# EAGLE schematic clock (EAGLE 7.3.0)
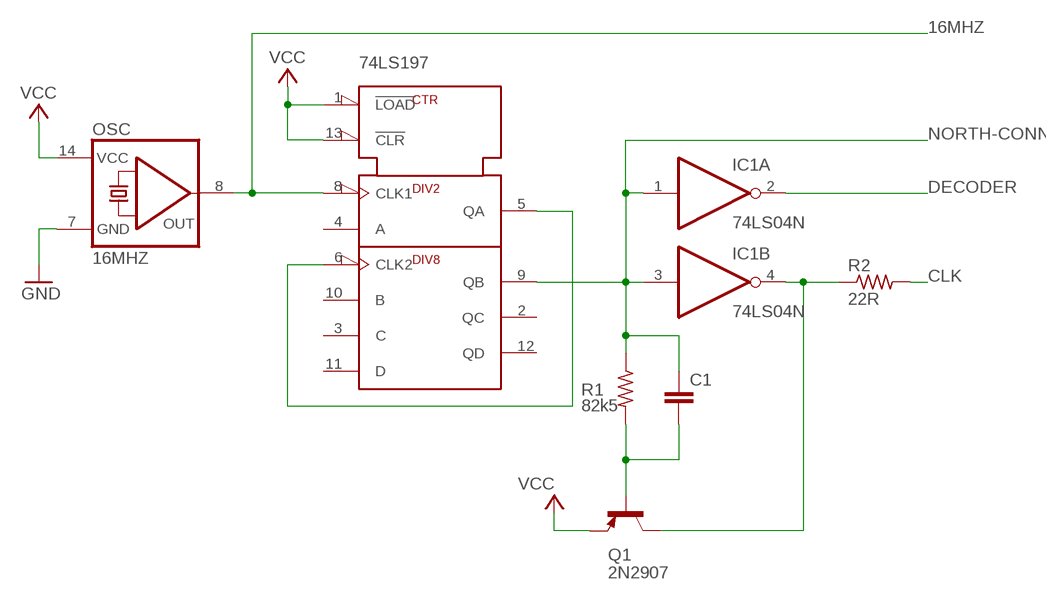
[diagram p0: schematic, sheet 1]

## Parts
C1  C-EU025-024X044  [C025-024X044]
IC1  74LS04N  [DIL14]
OSC  16MHZ  QG5860  [DIL14S]
Q1  2N2907  [TO18]
R1  82k5  R-US_0207/10  [0207/10]
R2  22R  R-US_0207/10  [0207/10]
U$1  74LS197  [DIL14]

## Nets
16MHZ: OSC.8(OUT) U$1.8(CLK1)
CLK: R2.2
DECODER: IC1.2(A:O)
GND: OSC.7(GND)
N$1: U$1.5(QA) U$1.6(CLK2)
N$4: IC1.4(B:O) Q1.3(C) R2.1
N$5: C1.2 Q1.2(B) R1.2
NORTH-CONN: C1.1 IC1.1(A:I) IC1.3(B:I) R1.1 U$1.9(QB)
VCC: OSC.14(VCC) Q1.1(E) U$1.1(!LOAD!) U$1.13(!CLR!)
Unconnected: IC1.5(C:I) IC1.6(C:O) IC1.8(D:O) IC1.9(D:I) IC1.10(E:O) IC1.11(E:I) IC1.12(F:O) IC1.13(F:I) U$1.2(QC) U$1.3(C) U$1.4(A) U$1.10(B) U$1.11(D) U$1.12(QD)

## Power pins joined to a net without a drawn wire
GND: IC1.7(P:GND) U$1.7(GND)
VCC: IC1.14(P:VCC) U$1.14(VCC)

## Library data of the parts
C1 = resistor:C-EU: CAPACITOR, European symbol
IC1 = 74xx-us:74*04: Hex INVERTER
OSC = crystal:QG5860: CRYSTAL RESONATOR; OC_FARNELL: unknown; OC_NEWARK: unknown
Q1 = transistor-pnp:2N2907*: PNP Transistor
R1 R2 = resistor:R-US_: RESISTOR, American symbol
U$1 = 74ls197:74LS197: 74LS197 High-speed monolythic divide-by-two and divide-by-eight counters.